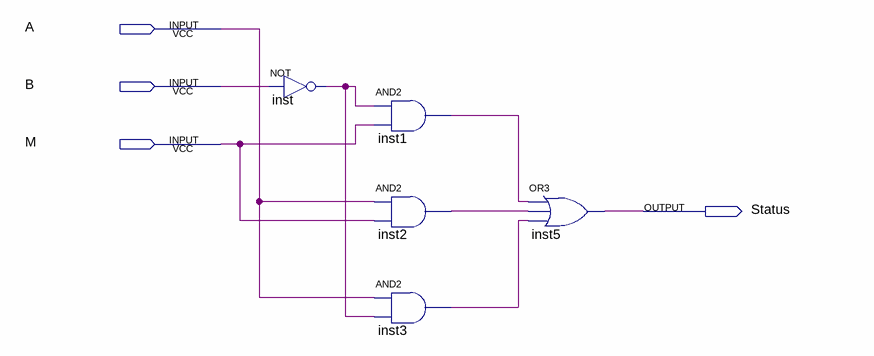
[diagram p0: schematic sheet]
// Quartus schematic a-maior-b-1bit.bdf as structural Verilog: 5 symbols, 4 pins
module \a-maior-b-1bit  (
  input  A,
  input  B,
  input  M,
  output Status
);

  wire inst1_out, inst2_out, inst3_out, inst_out;

  not inst (inst_out, B);
  and inst1 (inst1_out, inst_out, M);
  and inst2 (inst2_out, A, M);
  and inst3 (inst3_out, A, inst_out);
  or inst5 (Status, inst1_out, inst2_out, inst3_out);
endmodule
